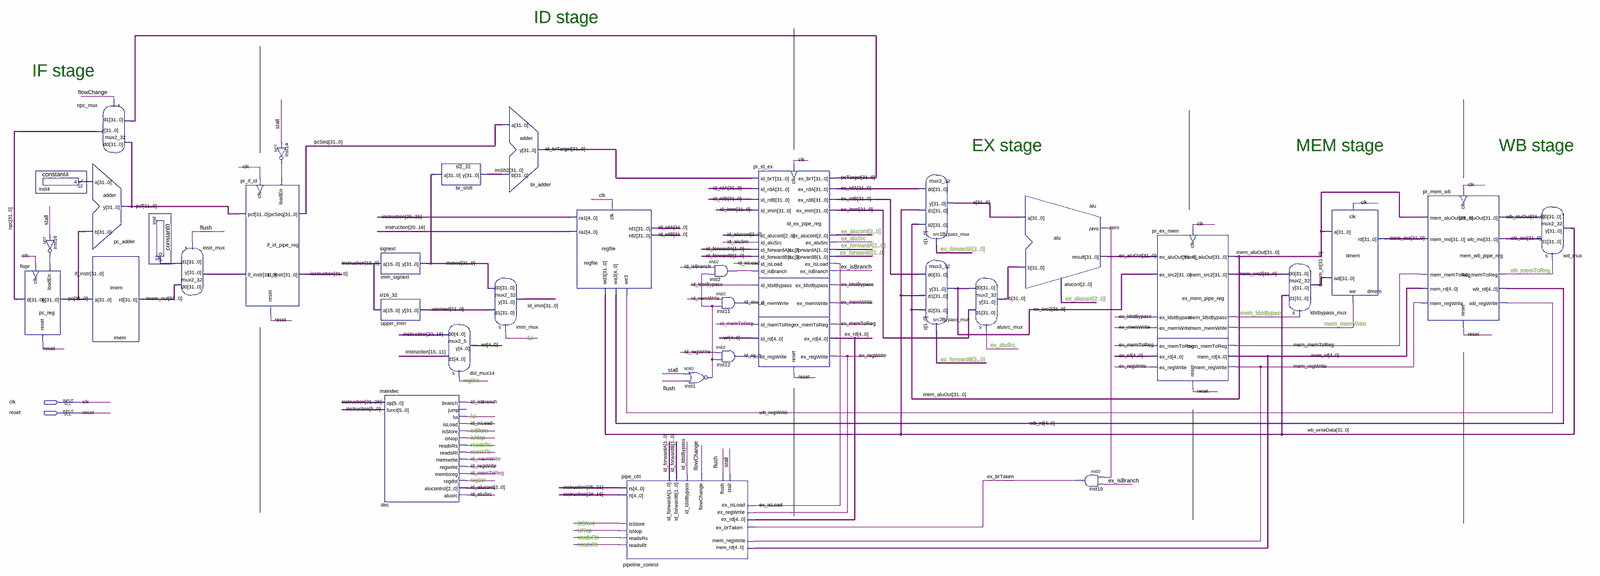
[diagram p0: schematic sheet, whole]
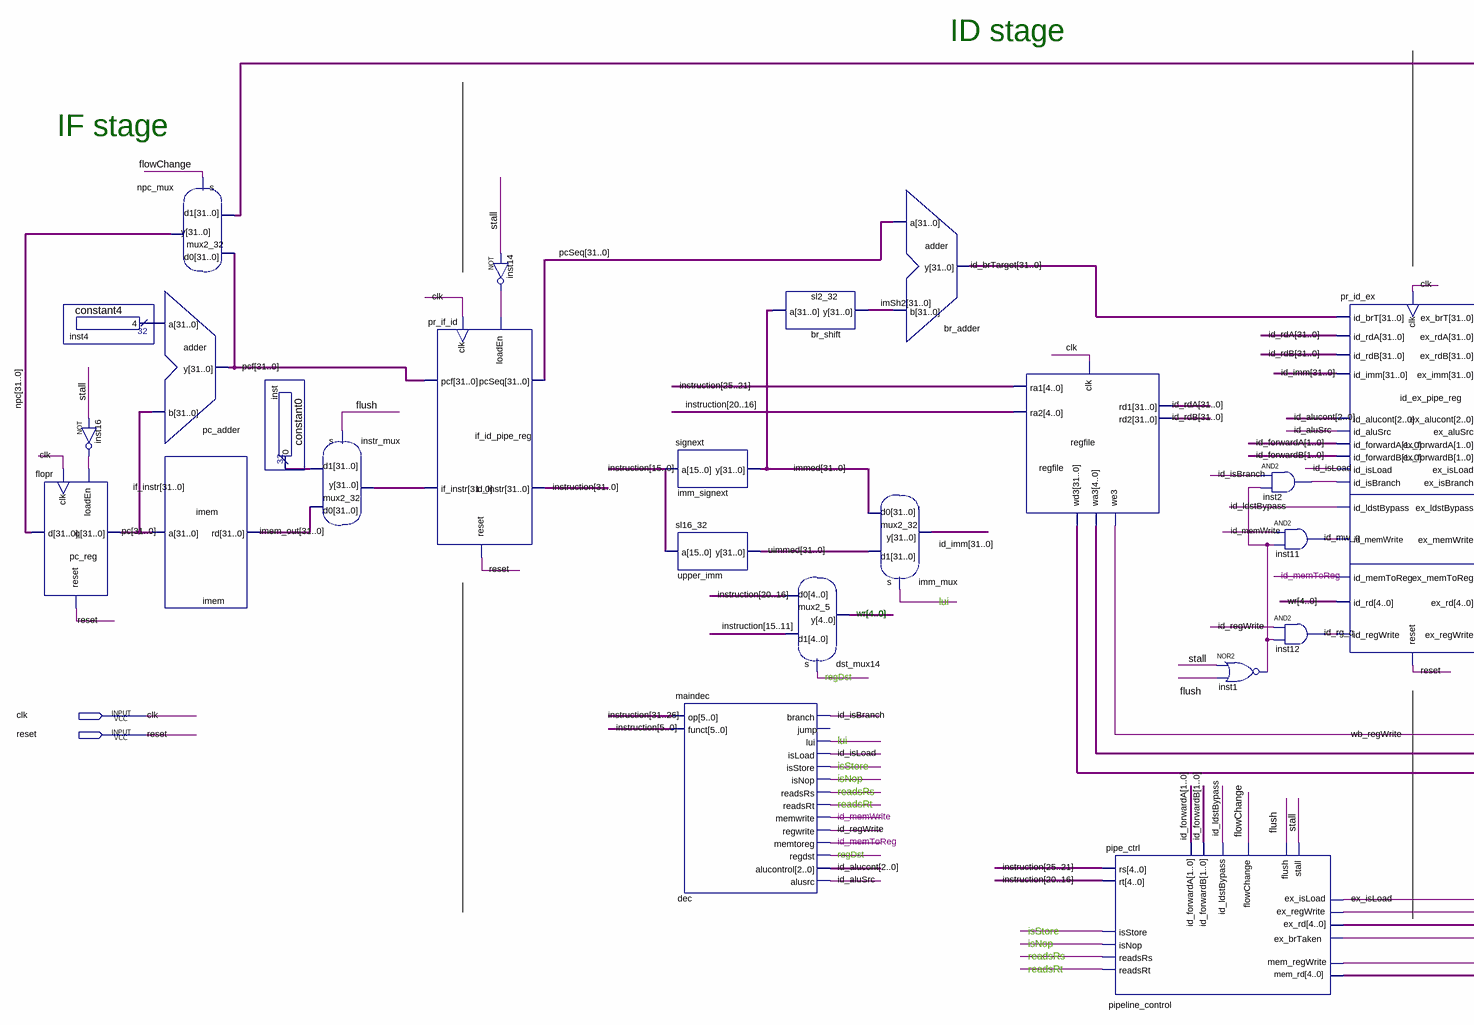
[diagram p1: schematic sheet, left part]
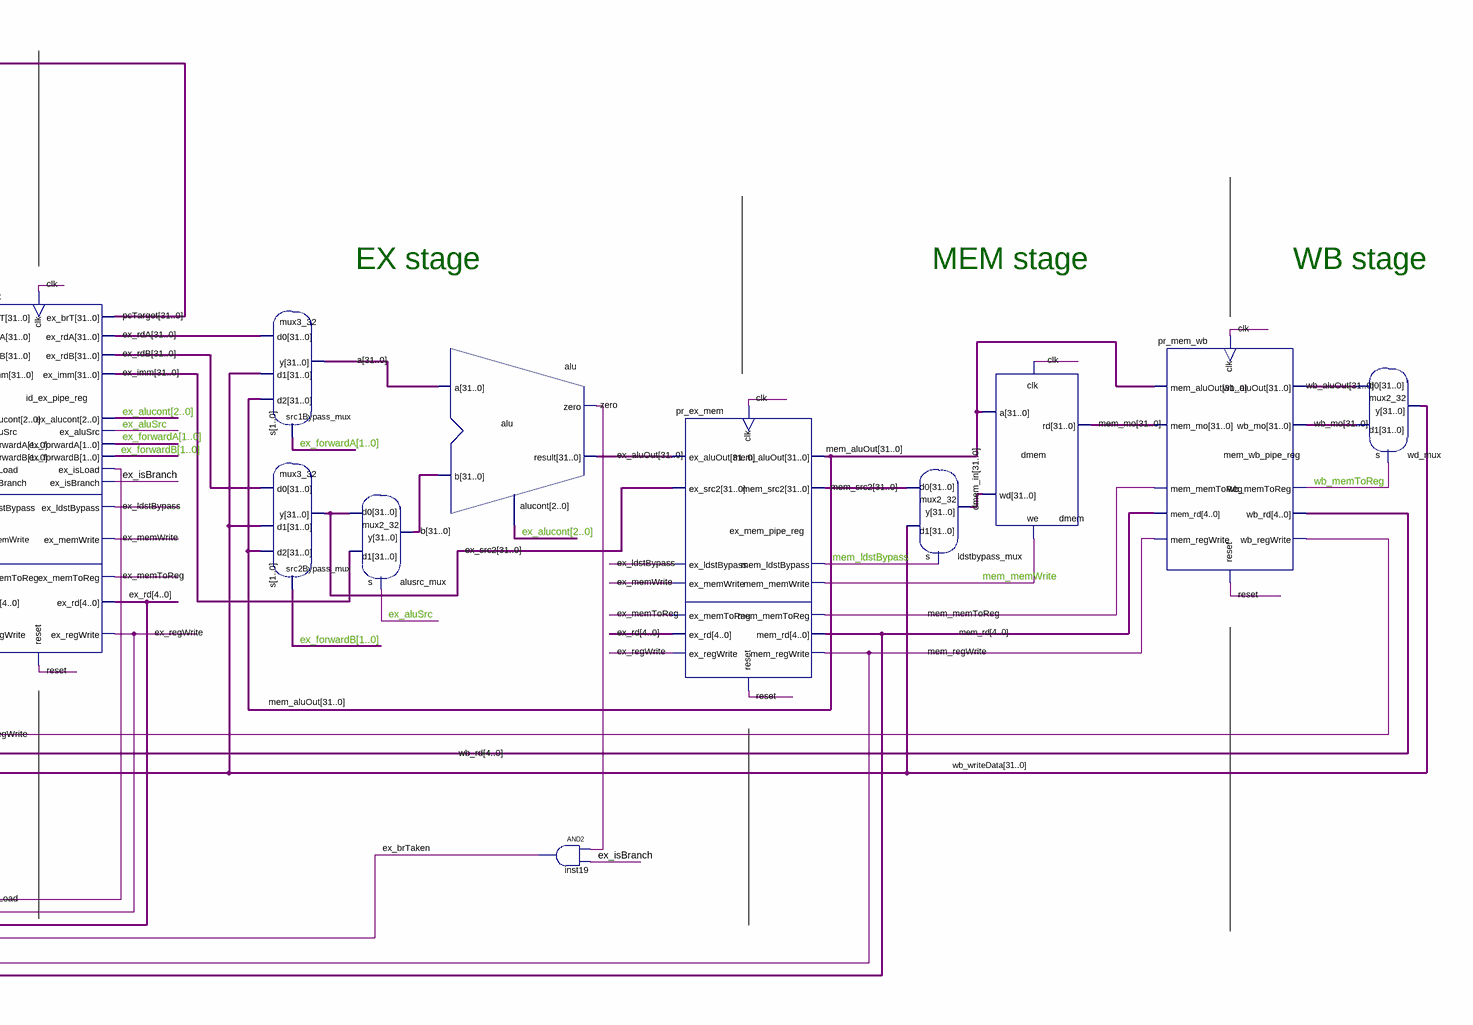
[diagram p2: schematic sheet, right part]
// Quartus schematic mips.bdf as structural Verilog: 34 symbols, 2 pins
module mips (
  input  clk,
  input  reset
);

  wire ex_aluSrc, ex_brTaken, ex_isBranch, ex_isLoad, ex_ldstBypass, ex_memToReg, ex_memWrite, ex_regWrite,
       flowChange, flush, id_aluSrc, id_isBranch, id_isLoad, id_ldstBypass, id_memToReg, id_memWrite,
       id_mw_q, id_regWrite, id_rg_q, inst1_out, inst2_out, inst14_out, inst16_out, isNop, isStore, lui,
       mem_ldstBypass, mem_memToReg, mem_memWrite, mem_regWrite, readsRs, readsRt, regDst, stall,
       wb_memToReg, wb_regWrite, zero;
  wire [1:0] ex_forwardA, ex_forwardB, id_forwardA, id_forwardB;
  wire [2:0] ex_alucont, id_alucont;
  wire [4:0] ex_rd, mem_rd, wb_rd, wr;
  wire [31:0] a, b, dmem_in, ex_aluOut, ex_imm, ex_rdA, ex_rdB, ex_src2, id_brTarget, id_imm, id_rdA, id_rdB,
       if_instr, imem_out, immed, imSh2, inst4_result, inst_result, instruction, mem_aluOut, mem_mo,
       mem_src2, npc, pc, pcf, pcSeq, pcTarget, uimmed, wb_aluOut, wb_mo, wb_writeData;

  flopr pc_reg (.clk(clk), .reset(reset), .loadEn(inst16_out), .d(npc), .q(pc));
  constant4 inst4 (.result(inst4_result));
  not inst16 (inst16_out, stall);
  mux2_32 npc_mux (.d0(pcf), .d1(pcTarget), .s(flowChange), .y(npc));
  adder pc_adder (.a(inst4_result), .b(pc), .y(pcf));
  imem imem (.a(pc), .rd(imem_out));
  constant0 inst (.result(inst_result));
  mux2_32 instr_mux (.d0(imem_out), .d1(inst_result), .s(flush), .y(if_instr));
  pr_if_id if_id_pipe_reg (
    .clk(clk), .reset(reset), .loadEn(inst14_out), .pcf(pcf), .if_instr(if_instr), .pcSeq(pcSeq),
    .id_instr(instruction));
  not inst14 (inst14_out, stall);
  signext imm_signext (.a(instruction[15:0]), .y(immed));
  sl16_32 upper_imm (.a(instruction[15:0]), .y(uimmed));
  maindec dec (
    .op(instruction[31:26]), .funct(instruction[5:0]), .branch(id_isBranch), .lui(lui), .isLoad(id_isLoad),
    .isStore(isStore), .isNop(isNop), .readsRs(readsRs), .readsRt(readsRt), .memwrite(id_memWrite),
    .regwrite(id_regWrite), .memtoreg(id_memToReg), .regdst(regDst), .alucontrol(id_alucont),
    .alusrc(id_aluSrc));  // open: jump
  sl2_32 br_shift (.a(immed), .y(imSh2));
  mux2_5 dst_mux14 (.d0(instruction[20:16]), .d1(instruction[15:11]), .s(regDst), .y(wr));
  adder br_adder (.a(pcSeq), .b(imSh2), .y(id_brTarget));
  mux2_32 imm_mux (.d0(immed), .d1(uimmed), .s(lui), .y(id_imm));
  regfile regfile (
    .clk(clk), .we3(wb_regWrite), .ra1(instruction[25:21]), .ra2(instruction[20:16]), .wa3(wb_rd),
    .wd3(wb_writeData), .rd1(id_rdA), .rd2(id_rdB));
  pipe_ctrl pipeline_control (
    .rs(instruction[25:21]), .rt(instruction[20:16]), .isStore(isStore), .isNop(isNop), .readsRs(readsRs),
    .readsRt(readsRt), .ex_rd(ex_rd), .ex_regWrite(ex_regWrite), .ex_isLoad(ex_isLoad), .mem_rd(mem_rd),
    .mem_regWrite(mem_regWrite), .ex_brTaken(ex_brTaken), .flush(flush), .flowChange(flowChange),
    .stall(stall), .id_forwardA(id_forwardA), .id_forwardB(id_forwardB), .id_ldstBypass(id_ldstBypass));
  nor inst1 (inst1_out, stall, flush);
  and inst2 (inst2_out, id_isBranch, inst1_out);
  and inst11 (id_mw_q, id_memWrite, inst1_out);
  and inst12 (id_rg_q, id_regWrite, inst1_out);
  pr_id_ex id_ex_pipe_reg (
    .clk(clk), .reset(reset), .id_brT(id_brTarget), .id_rdA(id_rdA), .id_rdB(id_rdB), .id_imm(id_imm),
    .id_alucont(id_alucont), .id_aluSrc(id_aluSrc), .id_forwardA(id_forwardA), .id_forwardB(id_forwardB),
    .id_isLoad(id_isLoad), .id_isBranch(inst2_out), .id_ldstBypass(id_ldstBypass), .id_memWrite(id_mw_q),
    .id_memToReg(id_memToReg), .id_rd(wr), .id_regWrite(id_rg_q), .ex_isBranch(ex_isBranch),
    .ex_brT(pcTarget), .ex_rdA(ex_rdA), .ex_rdB(ex_rdB), .ex_imm(ex_imm), .ex_alucont(ex_alucont),
    .ex_aluSrc(ex_aluSrc), .ex_forwardA(ex_forwardA), .ex_forwardB(ex_forwardB), .ex_isLoad(ex_isLoad),
    .ex_ldstBypass(ex_ldstBypass), .ex_memWrite(ex_memWrite), .ex_memToReg(ex_memToReg), .ex_rd(ex_rd),
    .ex_regWrite(ex_regWrite));
  mux3_32 src1Bypass_mux (.d0(ex_rdA), .d1(wb_writeData), .d2(mem_aluOut), .s(ex_forwardA), .y(a));
  mux3_32 src2Bypass_mux (.d0(ex_rdB), .d1(wb_writeData), .d2(mem_aluOut), .s(ex_forwardB), .y(ex_src2));
  mux2_32 alusrc_mux (.d0(ex_src2), .d1(ex_imm), .s(ex_aluSrc), .y(b));
  alu alu (.a(a), .b(b), .alucont(ex_alucont), .result(ex_aluOut), .zero(zero));
  and inst19 (ex_brTaken, zero, ex_isBranch);
  pr_ex_mem ex_mem_pipe_reg (
    .clk(clk), .reset(reset), .ex_aluOut(ex_aluOut), .ex_src2(ex_src2), .ex_memWrite(ex_memWrite),
    .ex_ldstBypass(ex_ldstBypass), .ex_memToReg(ex_memToReg), .ex_rd(ex_rd), .ex_regWrite(ex_regWrite),
    .mem_aluOut(mem_aluOut), .mem_src2(mem_src2), .mem_memWrite(mem_memWrite),
    .mem_ldstBypass(mem_ldstBypass), .mem_memToReg(mem_memToReg), .mem_rd(mem_rd), .mem_regWrite(mem_regWrite));
  mux2_32 ldstbypass_mux (.d0(mem_src2), .d1(wb_writeData), .s(mem_ldstBypass), .y(dmem_in));
  dmem dmem (.clk(clk), .we(mem_memWrite), .a(mem_aluOut), .wd(dmem_in), .rd(mem_mo));
  pr_mem_wb mem_wb_pipe_reg (
    .clk(clk), .reset(reset), .mem_aluOut(mem_aluOut), .mem_mo(mem_mo), .mem_memToReg(mem_memToReg),
    .mem_rd(mem_rd), .mem_regWrite(mem_regWrite), .wb_aluOut(wb_aluOut), .wb_mo(wb_mo),
    .wb_memToReg(wb_memToReg), .wb_rd(wb_rd), .wb_regWrite(wb_regWrite));
  mux2_32 wd_mux (.d0(wb_aluOut), .d1(wb_mo), .s(wb_memToReg), .y(wb_writeData));

  // Notes on the sheet:
  //   ID stage
  //   IF stage
  //   EX stage
  //   MEM stage
  //   WB stage
  //   wr[4..0]
endmodule
